# Altium schematic sheet APP_1_DAC.SchDoc
size Tabloid; SheetNumber: 8; SheetTotal: 13; Sheet_Name: DAC; Size: 11x17
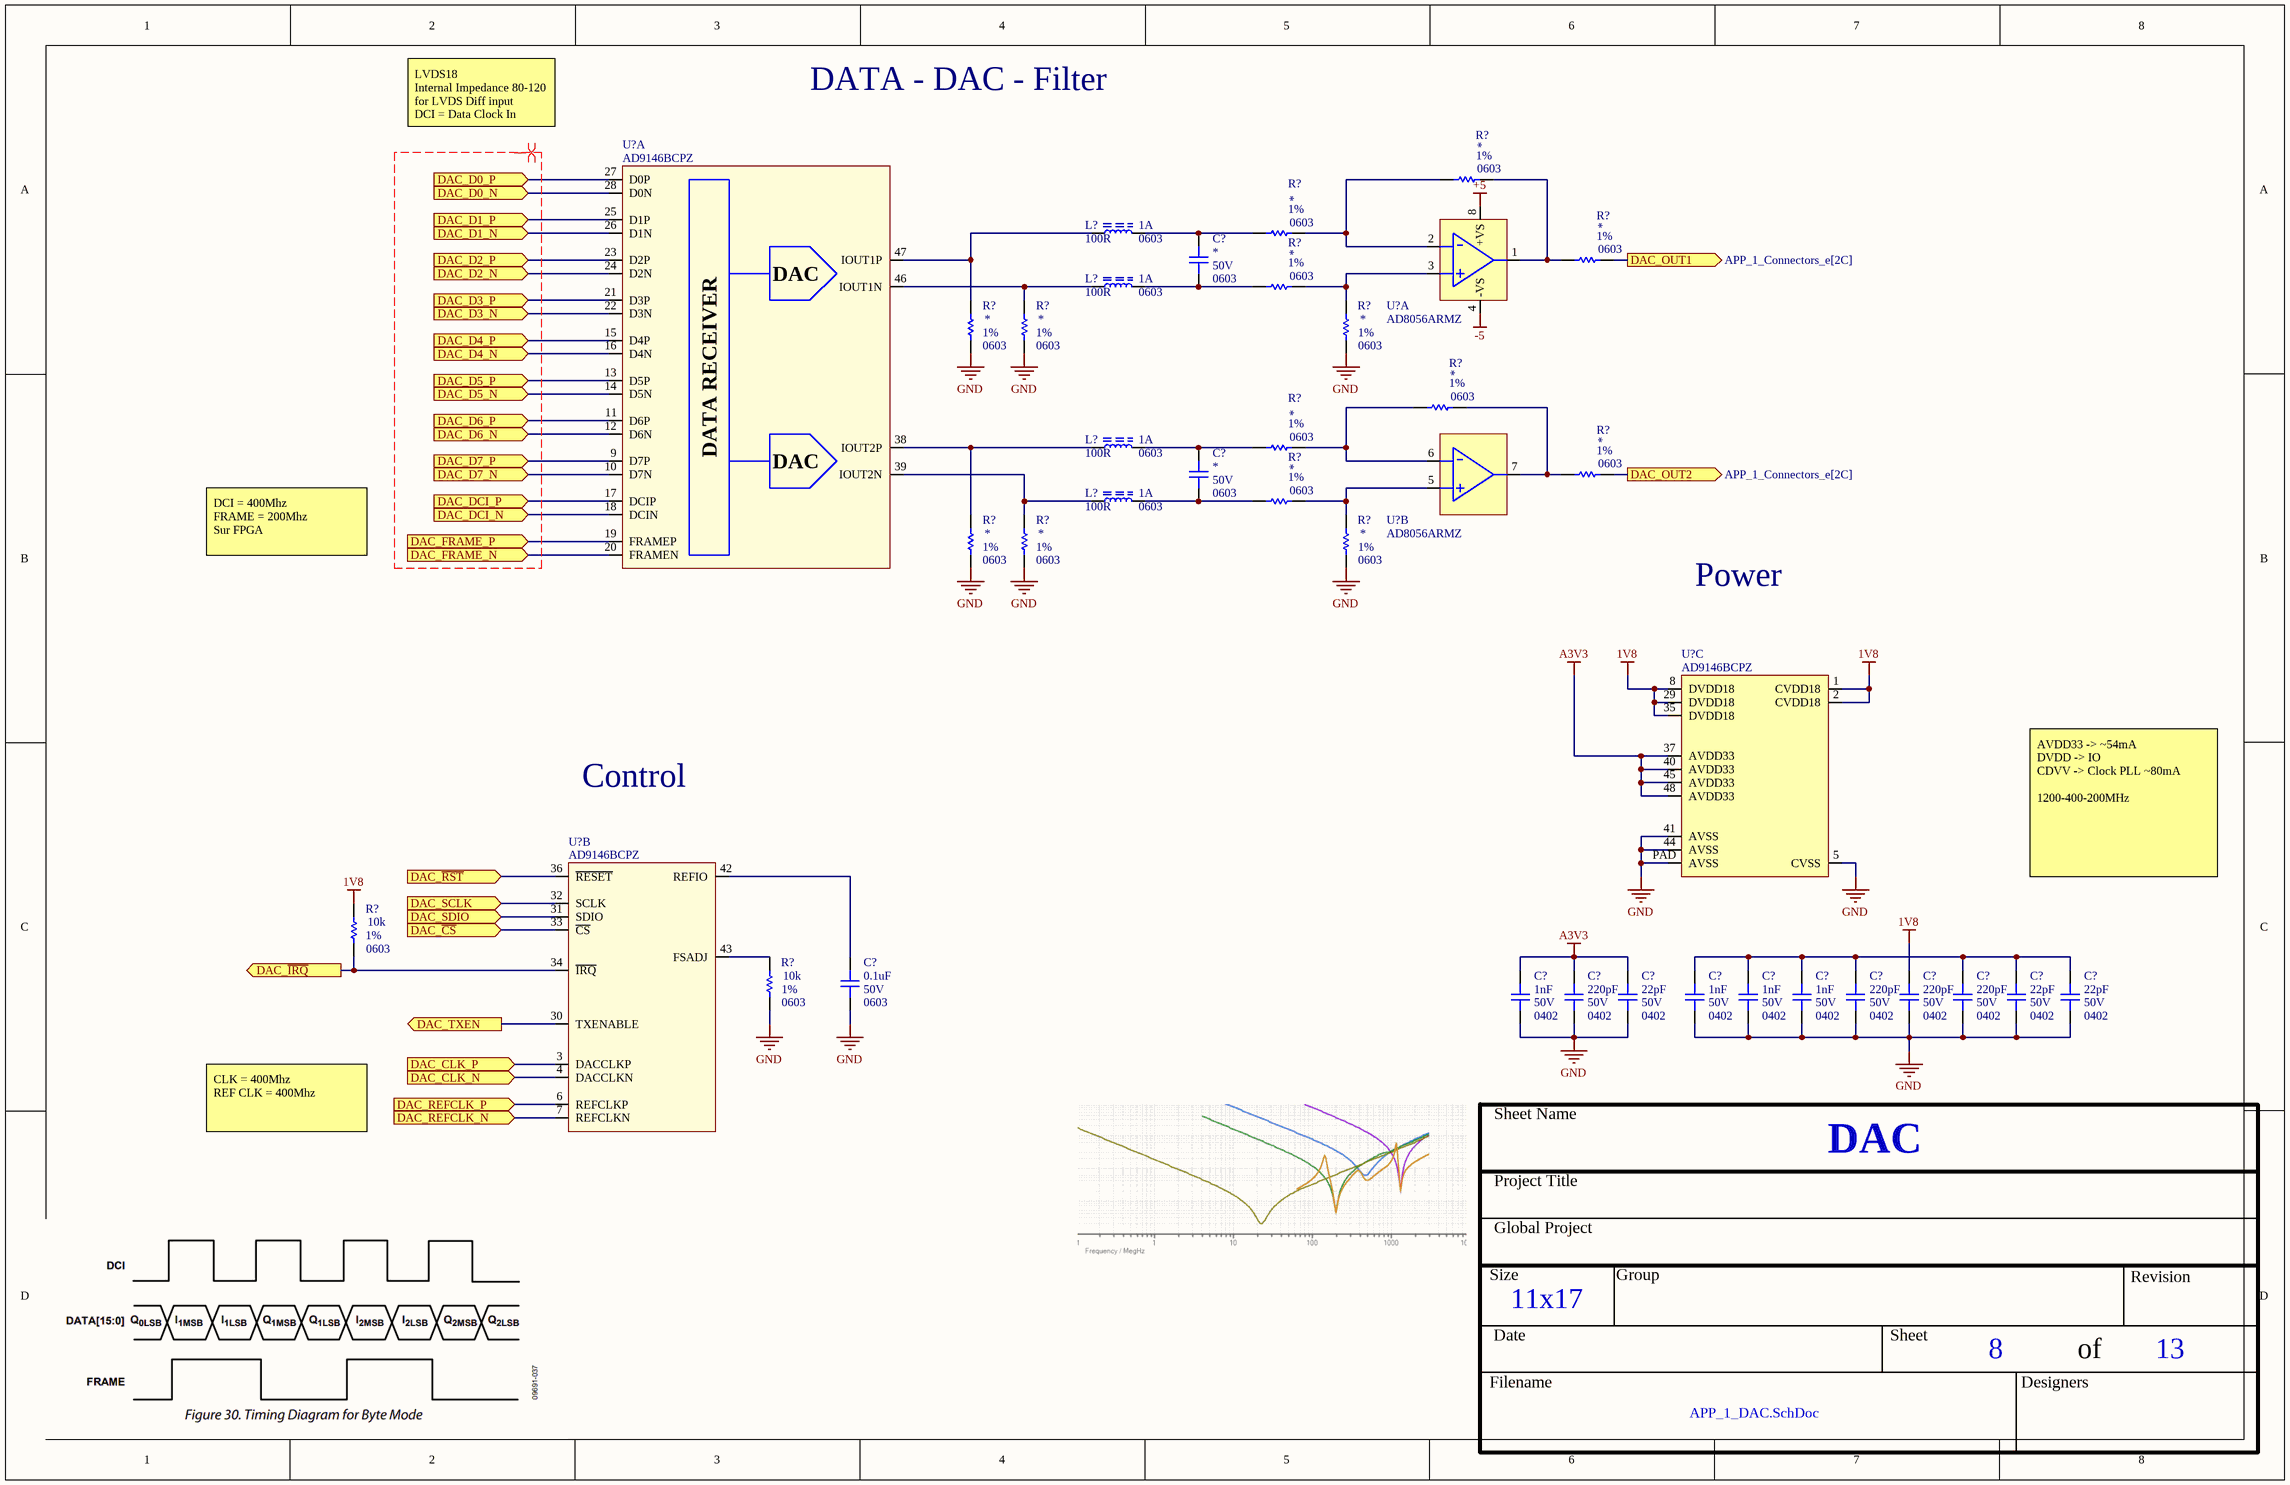
[diagram p0: APP_1_DAC.SchDoc]

## Parts
(Parts that share a designator on the sheet are numbered #1, #2 ... from top to bottom, then left to right.)
C?#1  Voltage: 50V  Package: 0603  [CAP_0603]  (hidden comment: CAP - 0603)
C?#2  Voltage: 50V  Package: 0603  [CAP_0603]  (hidden comment: CAP - 0603)
C?#3  value 0.1uF  Voltage: 50V  Package: 0603  [CAP_0603]  (hidden comment: CAP - 0603)
C?#4  value 1nF  Voltage: 50V  Package: 0402  [CAP_0402]  (hidden comment: CAP - 0402)
C?#5  value 220pF  Voltage: 50V  Package: 0402  [CAP_0402]  (hidden comment: CAP - 0402)
C?#6  value 22pF  Voltage: 50V  Package: 0402  [CAP_0402]  (hidden comment: CAP - 0402)
C?#7  value 1nF  Voltage: 50V  Package: 0402  [CAP_0402]  (hidden comment: CAP - 0402)
C?#8  value 1nF  Voltage: 50V  Package: 0402  [CAP_0402]  (hidden comment: CAP - 0402)
C?#9  value 1nF  Voltage: 50V  Package: 0402  [CAP_0402]  (hidden comment: CAP - 0402)
C?#10  value 220pF  Voltage: 50V  Package: 0402  [CAP_0402]  (hidden comment: CAP - 0402)
C?#11  value 220pF  Voltage: 50V  Package: 0402  [CAP_0402]  (hidden comment: CAP - 0402)
C?#12  value 220pF  Voltage: 50V  Package: 0402  [CAP_0402]  (hidden comment: CAP - 0402)
C?#13  value 22pF  Voltage: 50V  Package: 0402  [CAP_0402]  (hidden comment: CAP - 0402)
C?#14  value 22pF  Voltage: 50V  Package: 0402  [CAP_0402]  (hidden comment: CAP - 0402)
L?#1  value 100R  Current: 1A  Package: 0603  [FER_0603]  (hidden comment: FER - 0603)
L?#2  value 100R  Current: 1A  Package: 0603  [FER_0603]  (hidden comment: FER - 0603)
L?#3  value 100R  Current: 1A  Package: 0603  [FER_0603]  (hidden comment: FER - 0603)
L?#4  value 100R  Current: 1A  Package: 0603  [FER_0603]  (hidden comment: FER - 0603)
R?#1  Package: 0603  Precision: 1%  [RES_0603]  (hidden comment: RES - 0603)
R?#2  Package: 0603  Precision: 1%  [RES_0603]  (hidden comment: RES - 0603)
R?#3  Package: 0603  Precision: 1%  [RES_0603]  (hidden comment: RES - 0603)
R?#4  Package: 0603  Precision: 1%  [RES_0603]  (hidden comment: RES - 0603)
R?#5  Package: 0603  Precision: 1%  [RES_0603]  (hidden comment: RES - 0603)
R?#6  Package: 0603  Precision: 1%  [RES_0603]  (hidden comment: RES - 0603)
R?#7  Package: 0603  Precision: 1%  [RES_0603]  (hidden comment: RES - 0603)
R?#8  Package: 0603  Precision: 1%  [RES_0603]  (hidden comment: RES - 0603)
R?#9  Package: 0603  Precision: 1%  [RES_0603]  (hidden comment: RES - 0603)
R?#10  Package: 0603  Precision: 1%  [RES_0603]  (hidden comment: RES - 0603)
R?#11  Package: 0603  Precision: 1%  [RES_0603]  (hidden comment: RES - 0603)
R?#12  Package: 0603  Precision: 1%  [RES_0603]  (hidden comment: RES - 0603)
R?#13  Package: 0603  Precision: 1%  [RES_0603]  (hidden comment: RES - 0603)
R?#14  Package: 0603  Precision: 1%  [RES_0603]  (hidden comment: RES - 0603)
R?#15  value 10k  Package: 0603  Precision: 1%  [RES_0603]  (hidden comment: RES - 0603)
R?#16  value 10k  Package: 0603  Precision: 1%  [RES_0603]  (hidden comment: RES - 0603)
U?#1  AD9146BCPZ  [DAC_AD9146BCPZ]  (part A of 3)
U?#2  AD8056ARMZ  [OPAMP_AD8056ARMZ]  (part A of 2)
U?#3  AD8056ARMZ  [OPAMP_AD8056ARMZ]  (part B of 2)
U?#4  AD9146BCPZ  [DAC_AD9146BCPZ]  (part C of 3)
U?#5  AD9146BCPZ  [DAC_AD9146BCPZ]  (part B of 3)

## Ports
DAC_CLK_N (in), DAC_CLK_P (in), DAC_D0_N (in), DAC_D0_P (in), DAC_D1_N (in), DAC_D1_P (in), DAC_D2_N (in), DAC_D2_P (in), DAC_D3_N (in), DAC_D3_P (in), DAC_D4_N (in), DAC_D4_P (in), DAC_D5_N (in), DAC_D5_P (in), DAC_D6_N (in), DAC_D6_P (in), DAC_D7_N (in), DAC_D7_P (in), DAC_DCI_N (in), DAC_DCI_P (in), DAC_FRAME_N (in), DAC_FRAME_P (in), DAC_OUT1 (out, see APP_1_Connectors_e[2C]), DAC_OUT2 (out, see APP_1_Connectors_e[2C]), DAC_REFCLK_N (in), DAC_REFCLK_P (in), DAC_SCLK (in), DAC_SDIO (in), DAC_TXEN (out), DAC_~{CS} (in), DAC_~{IRQ} (out), DAC_~{RST} (in)

## Nets
1V8: C?#11.2 R?#15.2 U?#4.1(CVDD18) U?#4.2(CVDD18) U?#4.8(DVDD18) U?#4.29(DVDD18) U?#4.35(DVDD18)
+5: U?#2.8(+VS)
-5: U?#2.4(-VS)
A3V3: C?#4.2 C?#5.2 C?#6.2 U?#4.37(AVDD33) U?#4.40(AVDD33) U?#4.45(AVDD33) U?#4.48(AVDD33)
GND: C?#3.1 C?#4.1 C?#5.1 C?#6.1 C?#7.1 C?#8.1 C?#9.1 C?#10.1 C?#11.1 C?#12.1 C?#13.1 C?#14.1 R?#5.1 R?#6.1 R?#7.1 R?#12.1 R?#13.1 R?#14.1 R?#16.1 U?#4.5(CVSS) U?#4.41(AVSS) U?#4.44(AVSS) U?#4.PAD(AVSS)
DAC_~{CS}: U?#5.33(~{CS}) ; port DAC_~{CS}
DAC_CLK_N: U?#5.4(DACCLKN) ; port DAC_CLK_N
DAC_CLK_P: U?#5.3(DACCLKP) ; port DAC_CLK_P
DAC_D0_N: U?#1.28(D0N) ; port DAC_D0_N
DAC_D0_P: U?#1.27(D0P) ; port DAC_D0_P
DAC_D1_N: U?#1.26(D1N) ; port DAC_D1_N
DAC_D1_P: U?#1.25(D1P) ; port DAC_D1_P
DAC_D2_N: U?#1.24(D2N) ; port DAC_D2_N
DAC_D2_P: U?#1.23(D2P) ; port DAC_D2_P
DAC_D3_N: U?#1.22(D3N) ; port DAC_D3_N
DAC_D3_P: U?#1.21(D3P) ; port DAC_D3_P
DAC_D4_N: U?#1.16(D4N) ; port DAC_D4_N
DAC_D4_P: U?#1.15(D4P) ; port DAC_D4_P
DAC_D5_N: U?#1.14(D5N) ; port DAC_D5_N
DAC_D5_P: U?#1.13(D5P) ; port DAC_D5_P
DAC_D6_N: U?#1.12(D6N) ; port DAC_D6_N
DAC_D6_P: U?#1.11(D6P) ; port DAC_D6_P
DAC_D7_N: U?#1.10(D7N) ; port DAC_D7_N
DAC_D7_P: U?#1.9(D7P) ; port DAC_D7_P
DAC_DCI_N: U?#1.18(DCIN) ; port DAC_DCI_N
DAC_DCI_P: U?#1.17(DCIP) ; port DAC_DCI_P
DAC_FRAME_N: U?#1.20(FRAMEN) ; port DAC_FRAME_N
DAC_FRAME_P: U?#1.19(FRAMEP) ; port DAC_FRAME_P
DAC_~{IRQ}: R?#15.1 U?#5.34(~{IRQ}) ; port DAC_~{IRQ}
DAC_OUT1: R?#3.1 ; port DAC_OUT1
DAC_OUT2: R?#10.1 ; port DAC_OUT2
DAC_~{RST}: U?#5.36(~{RESET}) ; port DAC_~{RST}
DAC_REFCLK_N: U?#5.7(REFCLKN) ; port DAC_REFCLK_N
DAC_REFCLK_P: U?#5.6(REFCLKP) ; port DAC_REFCLK_P
DAC_SCLK: U?#5.32(SCLK) ; port DAC_SCLK
DAC_SDIO: U?#5.31(SDIO) ; port DAC_SDIO
DAC_TXEN: U?#5.30(TXENABLE) ; port DAC_TXEN
NetC?#1_1: C?#1.1 L?#2.1 R?#4.2
NetC?#1_2: C?#1.2 L?#1.1 R?#2.2
NetC?#2_1: C?#2.1 L?#4.1 R?#11.2
NetC?#2_2: C?#2.2 L?#3.1 R?#9.2
NetC?#3_2: C?#3.2 U?#5.42(REFIO)
NetC?#7_2: C?#7.2 C?#8.2 C?#9.2 C?#10.2 C?#12.2 C?#13.2 C?#14.2
NetL?#1_2: L?#1.2 R?#5.2 U?#1.47(IOUT1P)
NetL?#2_2: L?#2.2 R?#6.2 U?#1.46(IOUT1N)
NetL?#3_2: L?#3.2 R?#12.2 U?#1.38(IOUT2P)
NetL?#4_2: L?#4.2 R?#13.2 U?#1.39(IOUT2N)
NetR?#1_1: R?#1.1 R?#3.2 U?#2.1(OUT1)
NetR?#1_2: R?#1.2 R?#2.1 U?#2.2(-IN1)
NetR?#4_1: R?#4.1 R?#7.2 U?#2.3(+IN1)
NetR?#8_1: R?#8.1 R?#10.2 U?#3.7(OUT2)
NetR?#8_2: R?#8.2 R?#9.1 U?#3.6(-IN2)
NetR?#11_1: R?#11.1 R?#14.2 U?#3.5(+IN2)
NetR?#16_2: R?#16.2 U?#5.43(FSADJ)

## Layout directives
differential pair: (no net found under the mark)

## Notes on the sheet
- DATA - DAC - Filter
- LVDS18
  Internal Impedance 80-120 for LVDS Diff input
  DCI = Data Clock In
- DCI = 400Mhz
  FRAME = 200Mhz
  Sur FPGA
- Power
- Control
- AVDD33 -> ~54mA
  DVDD -> IO
  CDVV -> Clock PLL ~80mA
  1200-400-200MHz
- CLK = 400Mhz
  REF CLK = 400Mhz
- Sheet Name
- Project Title
- Global Project
- Size
- Group
- Revision
- Date
- Sheet
- of
- Filename
- Designers
- (in symbol DAC_AD9146BCPZ, part A) DAC; DATA RECEIVER

## Library data of the parts
C?#1-C?#3 = CAP - 0603: Precision: 10%; Current: *; CreatedBy: Jonathan Bouchard; Power: *
  C?#1 C?#2: Value: *
C?#4-C?#14 = CAP - 0402: Precision: 10%; Current: *; CreatedBy: Jonathan Bouchard; Power: *
U?#1 U?#4 U?#5 = DAC_AD9146BCPZ: DAC - 16BIT SRL HIGH SPEED - QFN-48; Voltage: 3.13 V ~ 3.47 V / 1.71 V ~ 1.89 V; Mfg: Analog Devices Inc.; Current: *; Power: *; Mfg Part Number: AD9146BCPZ; HelpURL: http://www.analog.com/media/en/technical-documentation/data-sheets/AD9146.PDF; CreatedBy: Jonathan Bouchard; Temperature: -40°C ~ 85°C; Value: *; Precision: 16 Bit; Package: QFN-48; Supplier 1: Digikey; Supplier Part Number 1: AD9146BCPZ-ND
U?#2 U?#3 = OPAMP_AD8056ARMZ: OPAMP - VFB 300MHZ - 8MSOP; Voltage: 8 V ~ 12 V, ±4 V ~ 6 V; Current: 60mA; Mfg: Analog Devices; Power: *; Mfg Part Number: AD8056ARMZ; HelpURL: http://www.analog.com/media/en/technical-documentation/data-sheets/AD8055_8056.pdf; CreatedBy: Jonathan Bouchard; Temperature: -40°C ~ 125°C; Value: *; Precision: *; Package: MSOP-8; Supplier 1: Digikey; Supplier Part Number 1: AD8056ARMZ-REEL7CT-ND
L?#1-L?#4 = FER - 0603: Voltage: *; CreatedBy: Jonathan Bouchard; Power: *; Precision: *
R?#1-R?#16 = RES - 0603: Current: *; CreatedBy: Jonathan Bouchard
  R?#1-R?#14: Value: *